# EAGLE design Stepper-Controller (EAGLE 9.6.2)
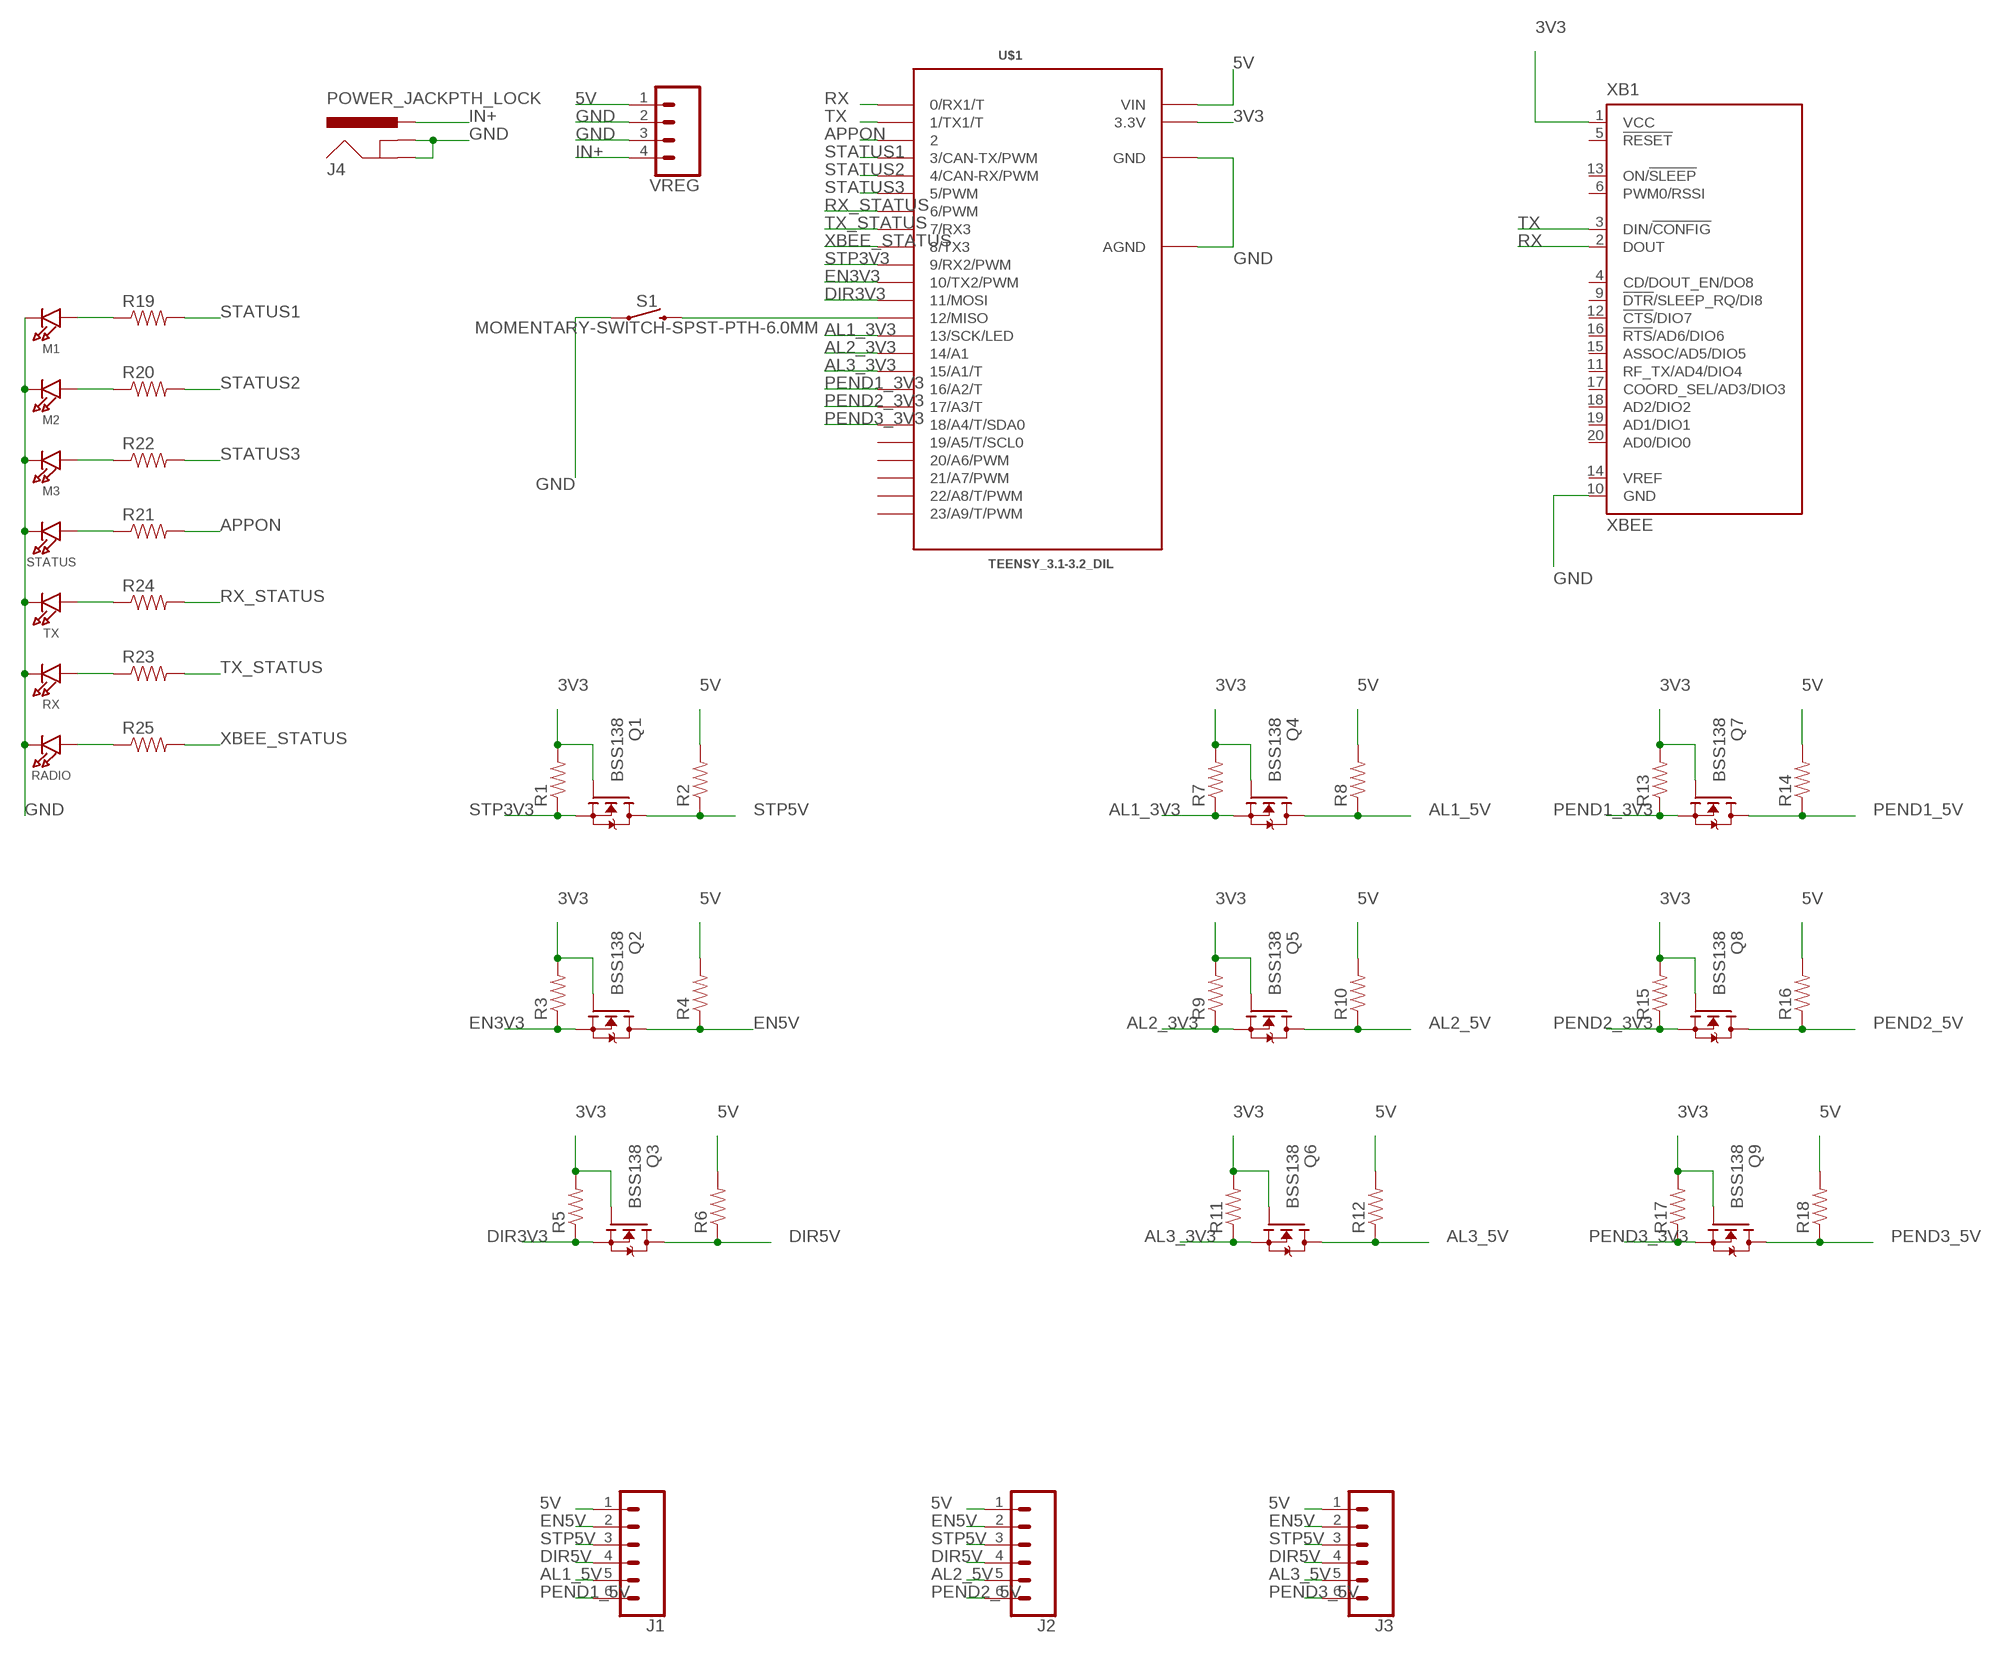
[diagram p0: schematic, sheet 1]

## Parts
J1  CONN_06NO_SILK_FEMALE_PTH  [1X06_NO_SILK]
J2  CONN_06NO_SILK_FEMALE_PTH  [1X06_NO_SILK]
J3  CONN_06NO_SILK_FEMALE_PTH  [1X06_NO_SILK]
J4  POWER_JACKPTH_LOCK  [POWER_JACK_PTH_LOCK]
M1  MICROBUILDER_LED0603  [MICROBUILDER_CHIPLED_0603]
M2  MICROBUILDER_LED0603  [MICROBUILDER_CHIPLED_0603]
M3  MICROBUILDER_LED0603  [MICROBUILDER_CHIPLED_0603]
Q1  BSS138  [SOT23]
Q2  BSS138  [SOT23]
Q3  BSS138  [SOT23]
Q4  BSS138  [SOT23]
Q5  BSS138  [SOT23]
Q6  BSS138  [SOT23]
Q7  BSS138  [SOT23]
Q8  BSS138  [SOT23]
Q9  BSS138  [SOT23]
R1  CONTROLBOARD_V1.0_SPARKFUN_RESISTOR0603-RES  [CONTROLBOARD_V1.0_SPARKFUN_0603-RES]
R2  CONTROLBOARD_V1.0_SPARKFUN_RESISTOR0603-RES  [CONTROLBOARD_V1.0_SPARKFUN_0603-RES]
R3  CONTROLBOARD_V1.0_SPARKFUN_RESISTOR0603-RES  [CONTROLBOARD_V1.0_SPARKFUN_0603-RES]
R4  CONTROLBOARD_V1.0_SPARKFUN_RESISTOR0603-RES  [CONTROLBOARD_V1.0_SPARKFUN_0603-RES]
R5  CONTROLBOARD_V1.0_SPARKFUN_RESISTOR0603-RES  [CONTROLBOARD_V1.0_SPARKFUN_0603-RES]
R6  CONTROLBOARD_V1.0_SPARKFUN_RESISTOR0603-RES  [CONTROLBOARD_V1.0_SPARKFUN_0603-RES]
R7  CONTROLBOARD_V1.0_SPARKFUN_RESISTOR0603-RES  [CONTROLBOARD_V1.0_SPARKFUN_0603-RES]
R8  CONTROLBOARD_V1.0_SPARKFUN_RESISTOR0603-RES  [CONTROLBOARD_V1.0_SPARKFUN_0603-RES]
R9  CONTROLBOARD_V1.0_SPARKFUN_RESISTOR0603-RES  [CONTROLBOARD_V1.0_SPARKFUN_0603-RES]
R10  CONTROLBOARD_V1.0_SPARKFUN_RESISTOR0603-RES  [CONTROLBOARD_V1.0_SPARKFUN_0603-RES]
R11  CONTROLBOARD_V1.0_SPARKFUN_RESISTOR0603-RES  [CONTROLBOARD_V1.0_SPARKFUN_0603-RES]
R12  CONTROLBOARD_V1.0_SPARKFUN_RESISTOR0603-RES  [CONTROLBOARD_V1.0_SPARKFUN_0603-RES]
R13  CONTROLBOARD_V1.0_SPARKFUN_RESISTOR0603-RES  [CONTROLBOARD_V1.0_SPARKFUN_0603-RES]
R14  CONTROLBOARD_V1.0_SPARKFUN_RESISTOR0603-RES  [CONTROLBOARD_V1.0_SPARKFUN_0603-RES]
R15  CONTROLBOARD_V1.0_SPARKFUN_RESISTOR0603-RES  [CONTROLBOARD_V1.0_SPARKFUN_0603-RES]
R16  CONTROLBOARD_V1.0_SPARKFUN_RESISTOR0603-RES  [CONTROLBOARD_V1.0_SPARKFUN_0603-RES]
R17  CONTROLBOARD_V1.0_SPARKFUN_RESISTOR0603-RES  [CONTROLBOARD_V1.0_SPARKFUN_0603-RES]
R18  CONTROLBOARD_V1.0_SPARKFUN_RESISTOR0603-RES  [CONTROLBOARD_V1.0_SPARKFUN_0603-RES]
R19  CONTROLBOARD_V1.0_SPARKFUN_RESISTOR0603-RES  [CONTROLBOARD_V1.0_SPARKFUN_0603-RES]
R20  CONTROLBOARD_V1.0_SPARKFUN_RESISTOR0603-RES  [CONTROLBOARD_V1.0_SPARKFUN_0603-RES]
R21  CONTROLBOARD_V1.0_SPARKFUN_RESISTOR0603-RES  [CONTROLBOARD_V1.0_SPARKFUN_0603-RES]
R22  CONTROLBOARD_V1.0_SPARKFUN_RESISTOR0603-RES  [CONTROLBOARD_V1.0_SPARKFUN_0603-RES]
R23  CONTROLBOARD_V1.0_SPARKFUN_RESISTOR0603-RES  [CONTROLBOARD_V1.0_SPARKFUN_0603-RES]
R24  CONTROLBOARD_V1.0_SPARKFUN_RESISTOR0603-RES  [CONTROLBOARD_V1.0_SPARKFUN_0603-RES]
R25  CONTROLBOARD_V1.0_SPARKFUN_RESISTOR0603-RES  [CONTROLBOARD_V1.0_SPARKFUN_0603-RES]
RADIO  MICROBUILDER_LED0603  [MICROBUILDER_CHIPLED_0603]
RX  MICROBUILDER_LED0603  [MICROBUILDER_CHIPLED_0603]
S1  MOMENTARY-SWITCH-SPST-PTH-6.0MM  [TACTILE_SWITCH_PTH_6.0MM]
STATUS  MICROBUILDER_LED0603  [MICROBUILDER_CHIPLED_0603]
TX  MICROBUILDER_LED0603  [MICROBUILDER_CHIPLED_0603]
U$1  TEENSY_3.1-3.2_DIL  [TEENSY_3.0-3.2&LC_DIL]
VREG  CONN_04LONGPADS  [1X04_LONGPADS]
XB1  XBEE  [XBEE]

## Nets
3V3: Q1.1(G) Q2.1(G) Q3.1(G) Q4.1(G) Q5.1(G) Q6.1(G) Q7.1(G) Q8.1(G) Q9.1(G) R1.2 R3.2 R5.2 R7.2 R9.2 R11.2 R13.2 R15.2 R17.2 U$1.3.3V XB1.1(VCC)
5V: J1.1 J2.1 J3.1 R2.2 R4.2 R6.2 R8.2 R10.2 R12.2 R14.2 R16.2 R18.2 U$1.VIN VREG.1
AL1_3V3: Q4.2(S) R7.1 U$1.13(13/SCK/LED)
AL1_5V: J1.5 Q4.3(D) R8.1
AL2_3V3: Q5.2(S) R9.1 U$1.14/A0(14/A1)
AL2_5V: J2.5 Q5.3(D) R10.1
AL3_3V3: Q6.2(S) R11.1 U$1.15/A1(15/A1/T)
AL3_5V: J3.5 Q6.3(D) R12.1
APPON: R21.2 U$1.2
DIR3V3: Q3.2(S) R5.1 U$1.11(11/MOSI)
DIR5V: J1.4 J2.4 J3.4 Q3.3(D) R6.1
EN3V3: Q2.2(S) R3.1 U$1.10(10/TX2/PWM)
EN5V: J1.2 J2.2 J3.2 Q2.3(D) R4.1
GND: J4.GND J4.GNDBREAK M1.C M2.C M3.C RADIO.C RX.C S1.1 STATUS.C TX.C U$1.AGND U$1.GND VREG.2 VREG.3 XB1.10(GND)
IN+: J4.PWR VREG.4
N$1: M1.A R19.1
N$2: M2.A R20.1
N$3: S1.3 U$1.12(12/MISO)
N$6: R21.1 STATUS.A
N$7: M3.A R22.1
N$10: R23.1 RX.A
N$11: R24.1 TX.A
N$14: R25.1 RADIO.A
PEND1_3V3: Q7.2(S) R13.1 U$1.16/A2(16/A2/T)
PEND1_5V: J1.6 Q7.3(D) R14.1
PEND2_3V3: Q8.2(S) R15.1 U$1.17/A3(17/A3/T)
PEND2_5V: J2.6 Q8.3(D) R16.1
PEND3_3V3: Q9.2(S) R17.1 U$1.18/A4(18/A4/T/SDA0)
PEND3_5V: J3.6 Q9.3(D) R18.1
RX: U$1.0(0/RX1/T) XB1.2(DOUT)
RX_STATUS: R24.2 U$1.6(6/PWM)
STATUS1: R19.2 U$1.3(3/CAN-TX/PWM)
STATUS2: R20.2 U$1.4(4/CAN-RX/PWM)
STATUS3: R22.2 U$1.5(5/PWM)
STP3V3: Q1.2(S) R1.1 U$1.9(9/RX2/PWM)
STP5V: J1.3 J2.3 J3.3 Q1.3(D) R2.1
TX: U$1.1(1/TX1/T) XB1.3(DIN/!CONFIG)
TX_STATUS: R23.2 U$1.7(7/RX3)
XBEE_STATUS: R25.2 U$1.8(8/TX3)
Unconnected: U$1.19/A5(19/A5/T/SCL0) U$1.20/A6(20/A6/PWM) U$1.21/A7(21/A7/PWM) U$1.22/A8(22/A8/T/PWM) U$1.23/A9(23/A9/T/PWM) XB1.4(CD/DOUT_EN/DO8) XB1.5(!RESET) XB1.6(PWM0/RSSI) XB1.9(!DTR!/SLEEP_RQ/DI8) XB1.11(RF_TX/AD4/DIO4) XB1.12(!CTS!/DIO7) XB1.13(ON/!SLEEP) XB1.14(VREF) XB1.15(ASSOC/AD5/DIO5) XB1.16(!RTS!/AD6/DIO6) XB1.17(COORD_SEL/AD3/DIO3) XB1.18(AD2/DIO2) XB1.19(AD1/DIO1) XB1.20(AD0/DIO0)

## Library data of the parts
J1-J3 = SparkFun-Connectors:CONN_06: Multi connection point. Often used as Generic Header-pin footprint for 0.1 inch spaced/style header connections On any of the 0.1 inch spaced packages, you can populate with these: Break Away Headers - Straight <https://www.sparkfun.com/products/116> (PRT-00116) Break Away Male Headers - Right Angle <https://www.sparkfun.com/products/553> (PRT-00553) Female Headers <https://www.sparkfun.com/products/115> (PRT-00115) Break Away Headers - Machine Pin <https://www.sparkfun.com/products/117> (PRT-00117) Break Away Female Headers - Swiss Machine Pin <https://www.sparkfun.com/products/743> (PRT-00743) Arduino Stackable Header - 6 Pin <https://www.sparkfun.com/products/9280> (PRT-09280) For SCREWTERMINALS and SPRING TERMINALS visit here: Screw Terimnals on SparkFun.com <https://www.sparkfun.com/search/results?term=Screw+Terminals> (5mm/3.5mm/2.54mm spacing) This device is also useful as a general connection point to wire up your design to another part of your project. Our various solder wires solder well into these plated through hole pads. Hook-Up Wire - Assortment (Stranded, 22 AWG) <https://www.sparkfun.com/products/11375> (PRT-11375) Hook-Up Wire - Assortment (Solid Core, 22 AWG) <https://www.sparkfun.com/products/11367> (PRT-11367) View the entire wire category on our website here <https://www.sparkfun.com/categories/141>; PROD_ID: CONN-08437
J4 = SparkFun-Connectors:POWER_JACK: Power Jack Connector This is the standard 5.5mm barrel jack for power. The PTH is the most common, proven, reliable, footprint. The Slot footprint only works if the mill layer is transmitted to the PCB fab house so be warned. Here are the connectors we sell at SparkFun: DC Barrel Power Jack/Connector <https://www.sparkfun.com/products/119> (PRT-00119) DC Barrel Power Jack/Connector (SMD) <https://www.sparkfun.com/products/12748> (PRT-12748) DC Barrel Jack Adapter - Breadboard Compatible <https://www.sparkfun.com/products/10811> (PRT-10811) It is used on this SparkFun product (and many, many others): SparkFun RedBoard - Programmed with Arduino <https://www.sparkfun.com/products/12757> (DEV-12757) Also, if you need a mating power supply or connector, please check these out: Wall Adapter Power Supply - 9VDC 650mA <https://www.sparkfun.com/products/298> (TOL-00298) DC Barrel Jack Adapter - Male <https://www.sparkfun.com/products/10287> (PRT-10287); PROD_ID: CONN-08197; SF_ID: PRT-00119
M1-M3 RADIO RX STATUS TX = Adafruit Feather M0 Basic rev C:MICROBUILDER_LED: LED 0603 - 0603 Surface Mount Package 2mA: Green LED - Low Power (3.9mcd, 2ma, 1.7Vf) - Digikey: 475-2709-2-ND Orange LED - Low Power (9.8mcd, 2ma, 1.8Vf) - Digikey: 475-1194-2-ND Red LED - Low Power (5mcd, 2ma, 1.8Vf) - Digikey: 475-1195-2-ND Yellow LED - Low Power (7mcd, 2ma, 1.8Vf) - Digikey: 475-1196-2-ND 5mA: Blue LED - Low Power (17mcd, 5ma, 2.9Vf) - Digikey: LNJ937W8CRACT-ND 0805 - 0805 Surface Mount Package 2mA: Red LED (8.8mcd, 2mA, 1.8Vf, Clear) - Low Power [Digikey: 475-2510-1-ND] Green LED (5mcd, 2mA, 1.8Vf, Clear) - Low Power [Digikey: 475-2730-1-ND] Yellow LED (11.3mcd, 2mA, 1.8Vf, Clear) - Low Power [Digikey: 475-2555-1-ND] 20mA: Red LED (104mcd, 20mA, Diffused) - LS R976 [Digikey: 475-1278-6-ND] Red LED (12mcd, 20mA, 2.0Vf, Clear) - APT2012EC [Digikey: 754-1128-1-ND] Green LED (15mcd, 20mA, 2.2Vf, Clear) - APT2012GC [Digikey: 754-1131-1-ND] Orange LED (160mcd, 20mA, 2.1Vf, Clear) - APT2012SECK [Digikey: 754-1130-1-ND] 1206 - 1206 Surface Mount Package Green LED (26mcd, 20mA, Diffused) - LG N971 [Digikey: 475-1407-6-ND] Red LED (15mcd, 20mA, Diffused) - LH N974 [Digikey: 475-1416-6-ND] Cree - Cree High-Power Surface Mount LEDs XPEBWT-L1-0000-00D50 - White 111lm 350mA 2.9Vf 6200K 110° XTEAWT-00-0000-00000LEE3 - White 114lm 350mA 2.85Vf 5000K 115° Everlight - Everlight 45-21 Series Surface Mount LEDs 45-21/QK2C-B2832AC2CB2/2T - Warm White 2000mcd 20mA 3.25Vf 3050K 120° 45-21/LK2C-B38452C4CB2/2T - Nuetral White 2000mcd 20mA 3.25Vf 4150K 120° 45-21/LK2C-B50634C6CB2/2T - Cold White 2200mcd 20mA 3.25Vf 5650K 120° PLCC2 Reverse Mount LS T77K-J1L2-1-0-2-R18-Z - Red 11.25mcd 2mA 1.8Vf 630nm 120° LO T77K-L1M2-24-Z - Orange 19.6mcd 2mA 1.8Vf 606nm 120° LY T77K-K2M1-26-Z - Yellow 15.7mcd 2mA 1.8Vf 587nm 120°
Q1-Q9 = bss138_10:BSS138: BSS138 N-Channel Logic Level Enhancement Mode Field Effect Transistor Source: http://www.fairchildsemi.com/datasheets/BS/BSS138.pdf; MF: Fairchild; MPN: BSS138; OC_FARNELL: 9845330; OC_NEWARK: 67R2009
R1-R25 = Lighting_Controller_1.1:CONTROLBOARD_V1.0_SPARKFUN_RESISTOR: Resistor Basic schematic elements and footprints for 0603, 1206, and PTH resistors.
S1 = SparkFun-Switches:MOMENTARY-SWITCH-SPST: Momentary Switch (Pushbutton) - SPST Normally-open (NO) SPST momentary switches (buttons, pushbuttons). Variants PTH-12MM - 12mm square, through-hole Momentary Pushbutton Switch - 12mm Square <https://www.sparkfun.com/products/9190> (COM-09190) PTH-6.0MM, PTH-6.0MM-KIT - 6.0mm square, through-hole Mini Pushbutton Switch <https://www.sparkfun.com/products/97> (COM-00097) KIT package intended for soldering kit's - only one side of pads' copper is exposed. PTH-RIGHT-ANGLE-KIT - Right-angle, through-hole Right Angle Tactile Button <https://www.sparkfun.com/products/10791> - Used on SparkFun BigTime Watch Kit <https://www.sparkfun.com/products/11734> SMD-12MM - 12mm square, surface-mount Tactile Button - SMD (12mm) <https://www.sparkfun.com/products/12993> (COM-12993) Used on SparkFun PicoBoard <https://www.sparkfun.com/products/11888> SMD-4.5MM - 4.5mm Square Trackball Switch Used on SparkFun Blackberry Trackballer Breakout <https://www.sparkfun.com/products/13169> SMD-4.6MMX2.8MM - 4.60mm x 2.80mm, surface mount Used on SparkFun SAMD21 Mini Breakout <https://www.sparkfun.com/products/13664> SMD-5.2MM, SMD-5.2-REDUNDANT - 5.2mm square, surface-mount Mini Pushbutton Switch - SMD <https://www.sparkfun.com/products/8720> (COM-08720) Used on Arduino Pro Mini <https://www.sparkfun.com/products/11114> REDUNDANT package connects both switch circuits together SMD-6.0X3.5MM - 6.0 x 3.5mm, surface mount Momentary Reset Switch SMD <https://www.sparkfun.com/products/8229> (COM-08229) SMD-6.2MM-TALL - 6.2mm square, surface mount Tactile Button - SMD (6mm) <https://www.sparkfun.com/products/12992> Used on SparkFun Digital Sandbox <https://www.sparkfun.com/products/12651> SMD-RIGHT-ANGLE - Right-angle, surface mount Used on SparkFun Block for Intel® Edison - Arduino <https://www.sparkfun.com/products/13036>; PROD_ID: SWCH-08441; SF_SKU: COM-00097
U$1 = Teensy_3_and_LC_Series_Boards_v1.4:TEENSY_3.1-3.2_DIL: Teensy 3.1 or 3.2 in a DIL Layout.
VREG = SparkFun-Connectors:CONN_04: Multi connection point. Often used as Generic Header-pin footprint for 0.1 inch spaced/style header connections On any of the 0.1 inch spaced packages, you can populate with these: Break Away Headers - Straight <https://www.sparkfun.com/products/116> (PRT-00116) Break Away Male Headers - Right Angle <https://www.sparkfun.com/products/553> (PRT-00553) Female Headers <https://www.sparkfun.com/products/115> (PRT-00115) Break Away Headers - Machine Pin <https://www.sparkfun.com/products/117> (PRT-00117) Break Away Female Headers - Swiss Machine Pin <https://www.sparkfun.com/products/743> (PRT-00743) For SCREWTERMINALS and SPRING TERMINALS visit here: Screw Terimnals on SparkFun.com <https://www.sparkfun.com/search/results?term=Screw+Terminals> (5mm/3.5mm/2.54mm spacing) This device is also useful as a general connection point to wire up your design to another part of your project. Our various solder wires solder well into these plated through hole pads. Hook-Up Wire - Assortment (Stranded, 22 AWG) <https://www.sparkfun.com/products/11375> (PRT-11375) Hook-Up Wire - Assortment (Solid Core, 22 AWG) <https://www.sparkfun.com/products/11367> (PRT-11367) View the entire wire category on our website here <https://www.sparkfun.com/categories/141> Special notes: Molex polarized connector foot print use with SKU : PRT-08231 with associated crimp pins and housings. 1MM SMD Version SKU: PRT-10208; PROD_ID: CONN-09696
XB1 = maxstream:XBEE: XBee (TM) /XBee-PRO(TM) OEM RF Modules Source: MaxStream, Inc. xbee_productmanual.pdf; MPN: XBP24-Z7UIT-004; OC_FARNELL: 1751799; OC_NEWARK: 34R5507

## Board
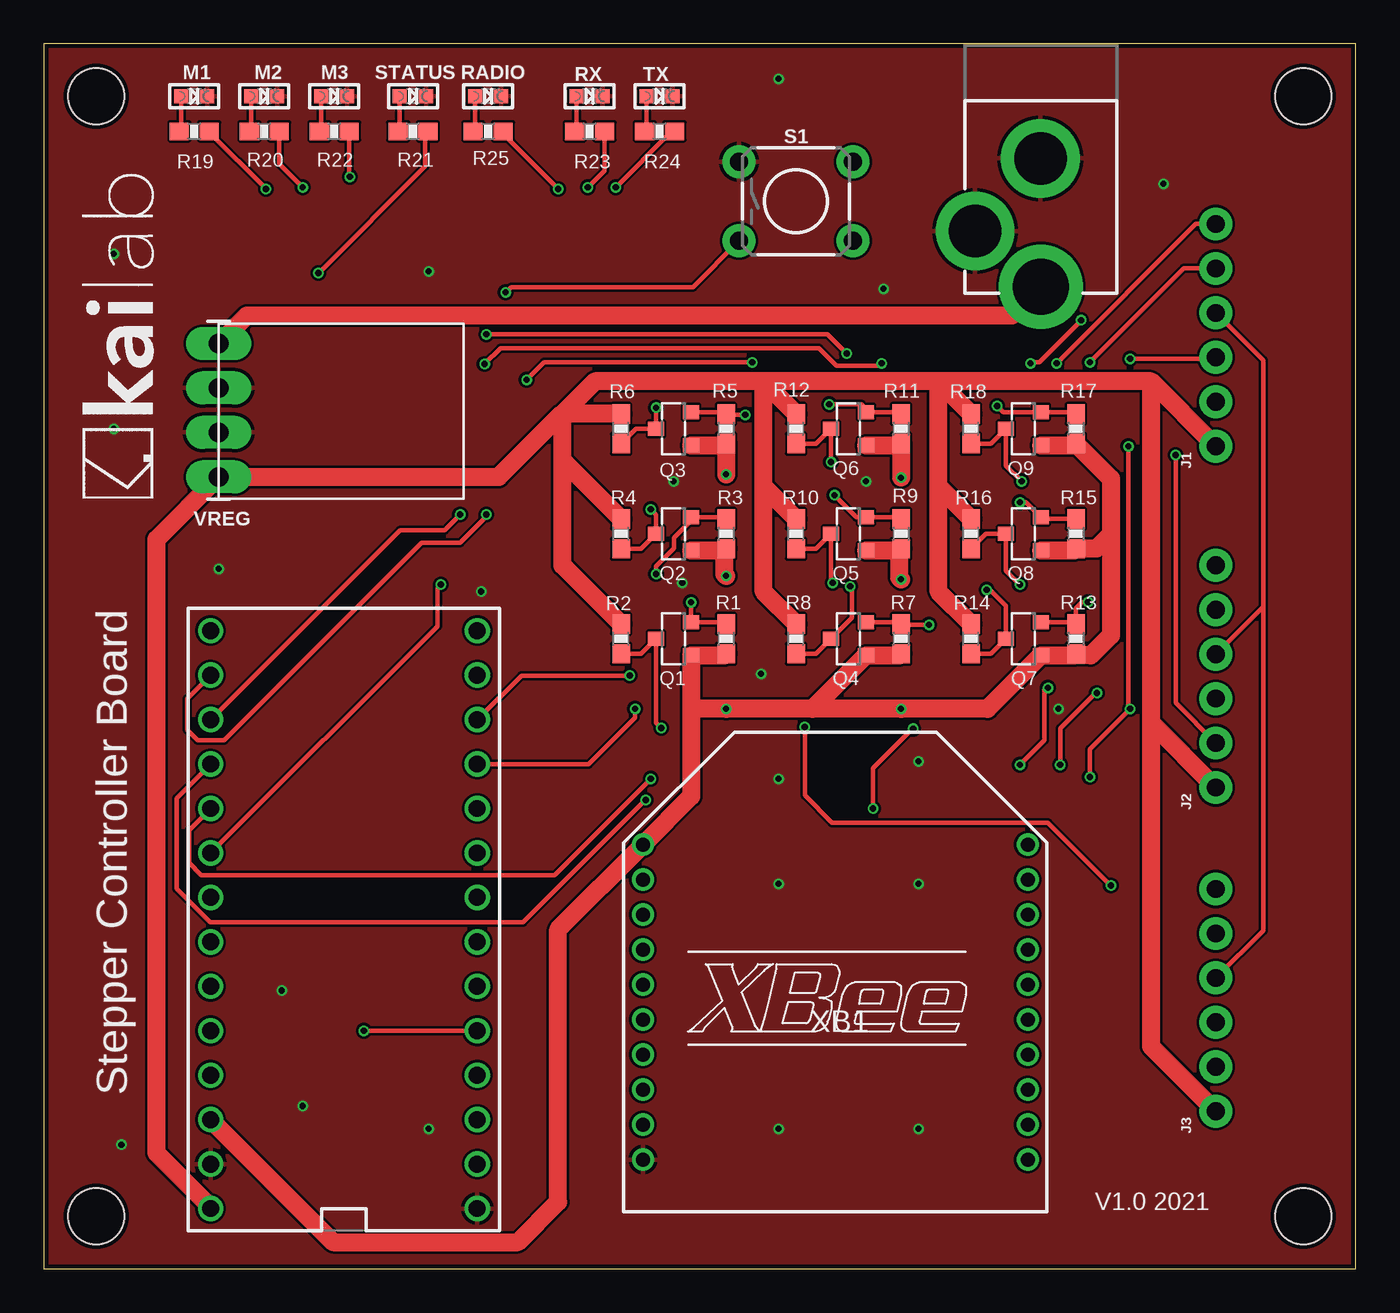
[diagram p1: board, top side]
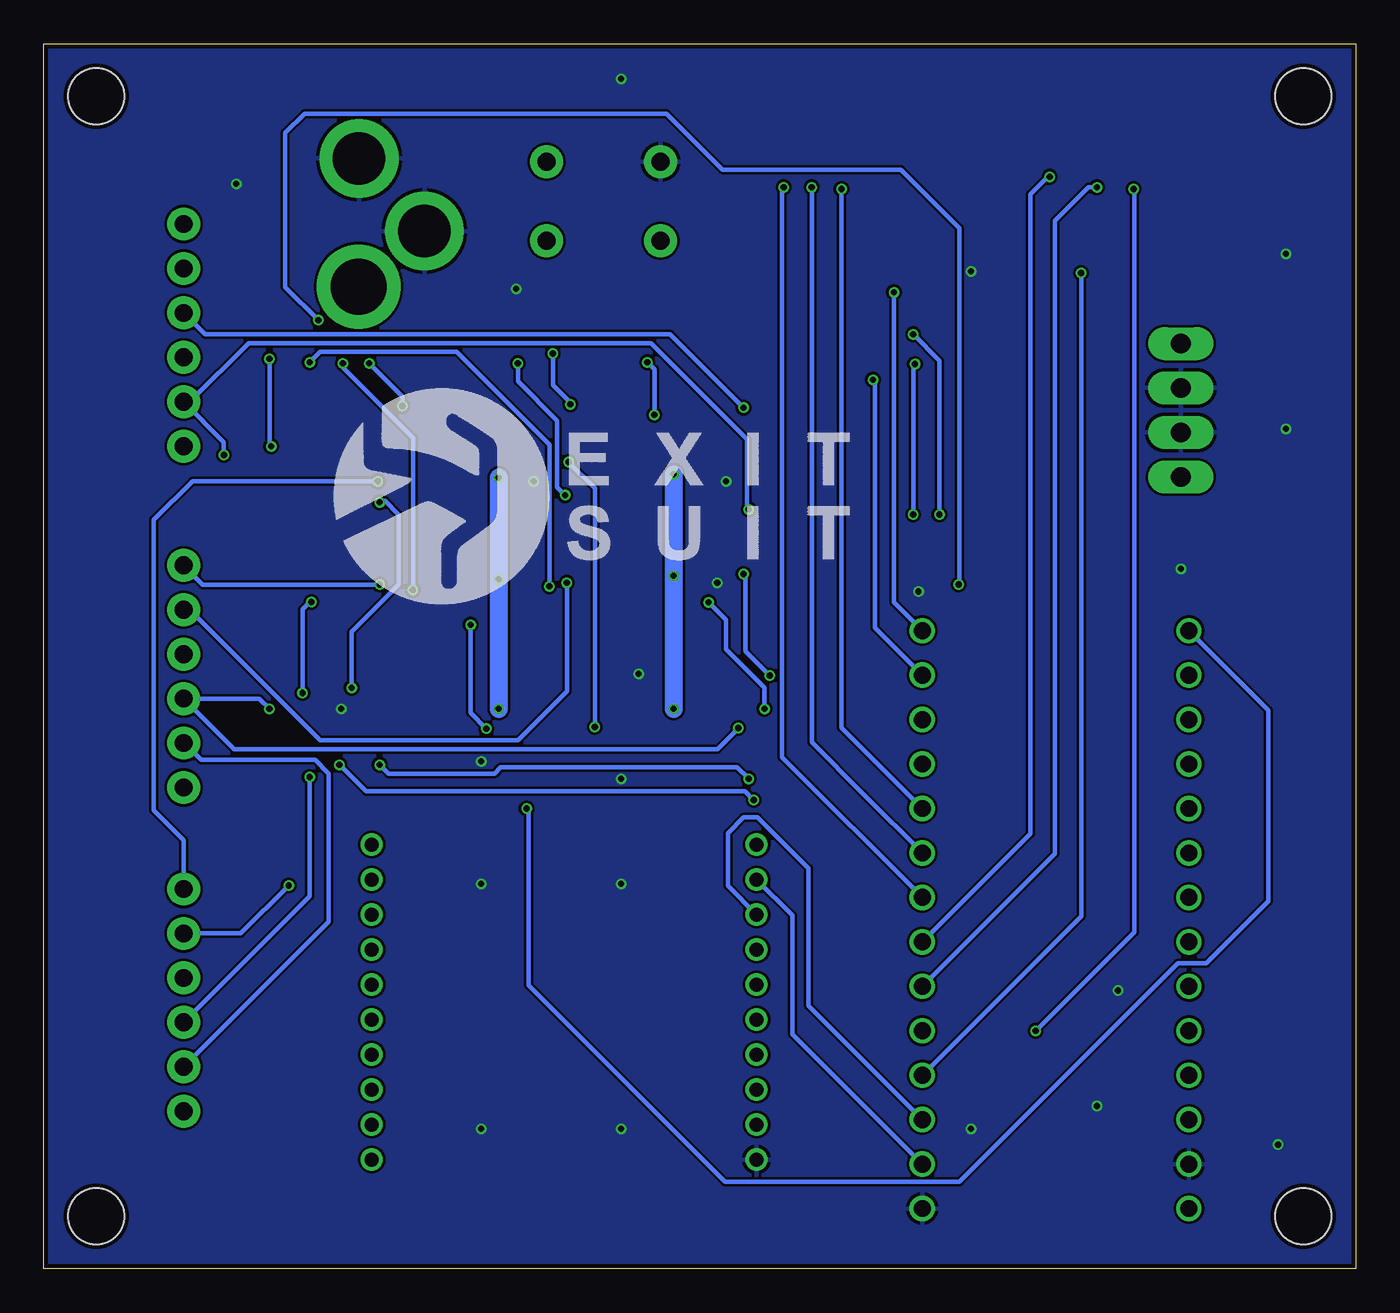
[diagram p2: board, bottom side, seen from below]

Size 75 x 70 mm. Coordinates in mm from the lower left corner, seen from the top.
Outline: 0,0 75,0 75,70 0,70 0,0
Copper layers (1*16): Top 0.018mm / dielectric 1.55mm / Bottom 0.018mm
Design rules "eC_2Layer_PClass6_BaseCopperO18_eCDefault": minimum track width 0.15mm, minimum drill 0.35mm, track to track 0.15mm, track to pad 0.15mm, pad to pad 0.15mm, via to via 0.15mm, smd to smd 0mil, copper to edge 0.25mm, drill to drill 0.35mm, minimum pad ring 0.175mm, minimum via ring 0.125mm, stop-mask expansion 0mil, vias tented up to drill 0.45mm, thermal gap 0.2mm
Holes 3.2 mm at 3,67 72,67 72,3 3,3

### Footprints (pad centres in the part's own frame; a part is rotated, then mirrored left to right if it is on the bottom)
1X06_NO_SILK = drill 1.016 pad 1.88: 1 0,0; 2 2.54,0; 3 5.08,0; 4 7.62,0; 5 10.16,0; 6 12.7,0
POWER_JACK_PTH_LOCK = drill 2.997 pad 4.115: GND 0.025,6.557; GNDBREAK 3.762,10.7 | drill 3.2 pad 4.115: PWR 0,13.878
MICROBUILDER_CHIPLED_0603 = smd 0.8 x 0.8: A 0,-0.75; C 0,0.75
SOT23 = smd 0.8 x 0.9: 1 -0.95,-1; 2 0.95,-1; 3 0,1
CONTROLBOARD_V1.0_SPARKFUN_0603-RES = smd 1.1 x 1: 1 -0.85,0; 2 0.85,0
TACTILE_SWITCH_PTH_6.0MM = drill 1.016 pad 1.88: 1 -3.251,2.261; 2 3.251,2.261; 3 -3.251,-2.261; 4 3.251,-2.261
TEENSY_3.0-3.2&LC_DIL = drill 0.965: 0 -7.62,13.97; 1 -7.62,11.43; 2 -7.62,8.89; 3 -7.62,6.35; 3.3V 7.62,11.43; 4 -7.62,3.81; 5 -7.62,1.27; 6 -7.62,-1.27; 7 -7.62,-3.81; 8 -7.62,-6.35; 9 -7.62,-8.89; 10 -7.62,-11.43; 11 -7.62,-13.97; 12 -7.62,-16.51; 13 7.62,-16.51; 14/A0 7.62,-13.97; 15/A1 7.62,-11.43; 16/A2 7.62,-8.89; 17/A3 7.62,-6.35; 18/A4 7.62,-3.81; 19/A5 7.62,-1.27; 20/A6 7.62,1.27; 21/A7 7.62,3.81; 22/A8 7.62,6.35; 23/A9 7.62,8.89; AGND 7.62,13.97; GND -7.62,16.51; VIN 7.62,16.51
1X04_LONGPADS = drill 1.118 pad 1.88 long: 1 0,0; 2 2.54,0; 3 5.08,0; 4 7.62,0
XBEE = drill 0.8 pad 1.27: 1 -11,9; 2 -11,7; 3 -11,5; 4 -11,3; 5 -11,1; 6 -11,-1; 7 -11,-3; 8 -11,-5; 9 -11,-7; 10 -11,-9; 11 11,-9; 12 11,-7; 13 11,-5; 14 11,-3; 15 11,-1; 16 11,1; 17 11,3; 18 11,5; 19 11,7; 20 11,9

### Placement (x,y rotation side)
J1  67,47 90 top
J2  67,27.5 90 top
J3  67,9 90 top
J4  57,70 180 top
M1  8.6,67 270 top
M2  12.6,67 270 top
M3  16.6,67 270 top
Q1  36,36 90 top
Q2  36,42 90 top
Q3  36,48 90 top
Q4  46,36 90 top
Q5  46,42 90 top
Q6  46,48 90 top
Q7  56,36 90 top
Q8  56,42 90 top
Q9  56,48 90 top
R1  39,36 270 top
R2  33,36 90 top
R3  39,42 270 top
R4  33,42 90 top
R5  39,48 270 top
R6  33,48 90 top
R7  49,36 270 top
R8  43,36 90 top
R9  49,42 270 top
R10  43,42 90 top
R11  49,48 270 top
R12  43,48 90 top
R13  59,36 270 top
R14  53,36 90 top
R15  59,42 270 top
R16  53,42 90 top
R17  59,48 270 top
R18  53,48 90 top
R19  8.6,65 0 top
R20  12.6,65 0 top
R21  21.1,65 0 top
R22  16.6,65 0 top
R23  31.2,65 0 top
R24  35.2,65 0 top
R25  25.4,65 0 top
RADIO  25.4,67 270 top
RX  31.2,67 270 top
S1  43,61 0 top
STATUS  21.1,67 270 top
TX  35.2,67 270 top
U$1  17.16,19.95 180 top
VREG  10,45.25 90 top
XB1  45.25,15.24 0 top

### Tracks (layer width: path | path; a pad name or v marks a point on that pad's centre or on a via)
3V3  (via drill 0.35)
  Top 1.016: U$1.3.3V 16.54,1.52 27.1,1.52 29.4,3.82 29.4,19.39 XB1.1 37,26.99 37,32 | 37,32 Q1.1 38.9,35.05 R1.2 | 43.95,32 Q4.1 48.9,35.05 R7.2 | 43.95,32 v39,32 37,32 | 43.95,32 v49,32 53.95,32 Q7.1 58.9,35.05 | Q3.1 38.9,47.05 R5.2 v39,45.4 | Q6.1 48.9,47.05 R11.2 v49,45.2 | Q9.1 58.9,47.05 R17.2 61,45.15 61,41.97 | Q8.1 58.9,41.05 R15.2 60.18,41.15 61,41.97 | Q5.1 48.9,41.05 | 48.9,41.05 R9.2 | Q2.1 38.9,41.05 | 38.9,41.05 R3.2 | 58.9,35.05 R13.2 | 61,41.97 61,36.2 59.85,35.05 58.9,35.05 | v39,39.6 38.9,39.7 38.9,41.05 | v49,39.4 48.9,39.5 48.9,41.05
  Bottom 1.016: v39,45.4 v39,39.6 v39,32 | v49,45.2 v49,39.4 v49,32
5V
  Top 1.016: R6.2 29.65,48.85 | R12.2 41.15,50.7 | 29.65,48.85 29.6,48.85 26,45.25 VREG.1 6.44,41.69 6.44,6.6 9.54,3.5 U$1.VIN | 41.15,50.7 31.5,50.7 29.65,48.85 | R18.2 51.15,50.7 | 51.15,50.7 41.15,50.7 | R4.2 29.65,46.2 | 29.65,46.2 29.65,48.85 | R10.2 41.15,44.7 | 41.15,44.7 41.15,50.7 | R16.2 51.15,44.7 | 51.15,44.7 51.15,50.7 | R14.2 51.15,38.7 51.15,44.7 | R8.2 41.15,38.7 41.15,44.7 | R2.2 29.65,40.2 29.65,46.2 | J1.1 63.3,50.7 | 63.3,50.7 51.15,50.7 | J2.1 63.3,31.2 | 63.3,31.2 63.3,50.7 | J3.1 63.3,12.7 63.3,31.2
AL1_3V3  (via drill 0.35)
  Top 0.254: Q4.2 48.9,36.95 R7.1 49.05,36.8 v50.6,36.8 | v47.4,26.3 47.4,28.6 49.66,30.86 v49.7,30.86
  Bottom 0.254: U$1.13 5,31.92 5,21 8.54,17.46 10.16,17.46 22.65,4.96 36.06,4.96 47.3,16.2 47.3,26.3 v47.4,26.3 | v49.7,30.86 50.6,31.76 v50.6,36.8
AL1_5V  (via drill 0.35)
  Top 0.254: R8.1 44.15,35.15 Q4.3 46.2,37.2 46.2,39 v46.1,39 | v59.8,51.8 65.16,57.16 J1.5
  Bottom 0.254: v46.1,39 46.1,47.1 51.4,52.4 59.2,52.4 v59.8,51.8
AL2_3V3  (via drill 0.35)
  Top 0.254: R9.1 48.9,42.95 Q5.2 46.45,42.95 v45.2,44.2 | U$1.14/A0 8.2,32.58 8.2,30.8 8.8,30.2 10.3,30.2 21.6,41.5 23.8,41.5 25.2,42.9 25.2,43.1 v25.3,43.1 | v25.2,51.7 26.1,52.6 44.3,52.6 45.3,51.6 47.9,51.6 v47.9,51.74
  Bottom 0.254: v25.3,43.1 25.3,51.7 v25.2,51.7 | v47.9,51.74 47.9,50.7 45.66,48.46 45.66,44.66 v45.2,44.2
AL2_5V  (via drill 0.35)
  Top 0.254: R10.1 44.15,41.15 Q5.3 45,39.3 v45.1,39.2
  Bottom 0.254: v45.1,39.2 45.1,33 47.9,30.2 59.2,30.2 66.66,37.66 J2.5
AL3_3V3  (via drill 0.35)
  Top 0.254: Q6.2 47.2,48.95 | 47.2,48.95 48.9,48.95 R11.1 | U$1.15/A1 20.36,42.2 22.9,42.2 v23.8,43.1 | v25.3,53.4 44.8,53.4 v45.9,52.3 | v44.9,49.4 46.75,49.4 47.2,48.95
  Bottom 0.254: v25.3,53.4 23.8,51.9 v23.8,43.1 | v45.9,52.3 45.9,50.5 44.9,49.5 v44.9,49.4
AL3_5V  (via drill 0.35)
  Top 0.254: R12.1 44.15,47.15 Q6.3 v45,46.1 | v43.5,30.96 43.5,27.06 45.06,25.5 57.4,25.5 v61,21.9
  Bottom 0.254: v45,46.1 43.5,44.6 v43.5,30.96 | v61,21.9 63.74,19.16 J3.5
APPON  (via drill 0.35)
  Top 0.254: v15.7,56.9 21.8,63 21.8,64.85 R21.2
  Bottom 0.254: U$1.2 15.7,20.14 v15.7,56.9
DIR3V3  (via drill 0.35)
  Top 0.254: Q3.2 38.9,48.95 R5.1 39.05,48.8 v40.1,48.8 | v27.6,50.8 28.6,51.8 v40.5,51.8
  Bottom 0.254: U$1.11 27.5,36.64 27.5,50.7 v27.6,50.8 | v40.5,51.8 40.1,51.4 v40.1,48.8
DIR5V  (via drill 0.35)
  Top 0.254: R6.1 33.85,48 Q3.3 v35,49.2 | J1.4 69.7,51.92 69.7,37.82 | 69.7,37.82 J2.4 | J3.4 69.7,19.32 69.7,37.82
  Bottom 0.254: v35,49.2 39.2,53.4 65.78,53.4 J1.4
EN3V3  (via drill 0.35)
  Top 0.254: R3.1 38.9,42.95 Q2.2 37,42.75 36.03,41.78 36.03,41.18 35,40.16 v35,39.7 | U$1.10 27.3,33.9 v33.5,33.9
  Bottom 0.254: v33.5,33.9 34.9,35.3 34.9,39.7 v35,39.7
EN5V  (via drill 0.35)
  Top 0.254: R4.1 34.15,41.15 Q2.3 35,43.1 v34.7,43.4 | v64.7,46.5 64.7,32.34 J2.2
  Bottom 0.254: v34.7,43.4 34.8,43.4 34.8,47.4 40.3,52.9 63.3,52.9 66.66,49.54 J1.2 64.7,47.24 v64.7,46.5 | J3.2 58.7,19.84 58.7,28.3 59.49,29.09 65.99,29.09 66.94,30.04 J2.2
GND  (via drill 0.35)
  other vias: 4,58 22,57 42,68 48,56 64,62 4,48 10,40 25,38.7 42,28 50,29 58,32 50,22 42,22 42,8 50,8 14.8,9.3 22,8 13.6,15.9 4.44,7.09 41,34 47,45 36.5,39.2 36,45
  pour Top: 0,70 75,70 75,0 0,0
  pour Bottom: 0,70 75,70 75,0 0,0
IN+
  Top 1.016: J4.PWR 55.35,54.47 11.6,54.47 VREG.4
N$1
  Top 0.254: M1.A 7.85,65.1 R19.1
N$2
  Top 0.254: M2.A 11.85,65.1 R20.1
N$3  (via drill 0.35)
  Top 0.254: S1.3 37.11,56.1 26.7,56.1 v26.4,55.8
  Bottom 0.254: v26.4,55.8 26.4,38.08 U$1.12
N$6
  Top 0.254: STATUS.A 20.35,65.1 R21.1
N$7
  Top 0.254: M3.A 15.85,65.1 R22.1
N$10
  Top 0.254: RX.A 30.45,65.1 R23.1
N$11
  Top 0.254: TX.A 34.45,65.1 R24.1
N$14
  Top 0.254: RADIO.A 24.65,65.1 R25.1
PEND1_3V3  (via drill 0.35)
  Top 0.254: Q7.2 58.9,36.95 R13.1 59,37.75 59.35,38.1 v59.7,38.1 | U$1.16/A2 7.6,26.9 7.6,21.72 9.52,19.8 27.4,19.8 v34.4,26.8 v34.41,26.79 | v58.1,28.8 58.1,30.9 60.1,32.9 v60.2,32.9
  Bottom 0.254: v34.41,26.79 34.91,27.29 56.59,27.29 v58.1,28.8 | v60.2,32.9 60.2,37.7 59.8,38.1 v59.7,38.1
PEND1_5V  (via drill 0.35)
  Top 0.254: R14.1 54.15,35.15 Q7.3 55,37.9 54,38.9 v53.9,38.8 | v57.9,51.74 65.86,59.7 J1.6
  Bottom 0.254: v53.9,38.8 53.9,47.5 57.9,51.5 v57.9,51.74
PEND2_3V3  (via drill 0.35)
  Top 0.254: R15.1 57.1,42.85 Q8.2 56.15,43.8 v55.8,43.8 | U$1.17/A3 8.3,25.06 8.3,23.2 9,22.5 29.2,22.5 v34.7,28 | v55.8,28.8 57.2,30.2 57.2,33.1 57.3,33.2 v57.4,33.2
  Bottom 0.254: v34.7,28 35.36,28.66 48.87,28.66 49.23,28.3 55.3,28.3 v55.8,28.8 | v57.4,33.2 57.4,36.4 54.7,39.1 54.7,43.1 55.5,43.9 55.8,43.9 v55.8,43.8
PEND2_5V  (via drill 0.35)
  Top 0.254: R16.1 53.85,42 Q8.3 55,39.9 v55.8,39.1
  Bottom 0.254: v55.8,39.1 65.9,39.1 J2.6
PEND3_3V3  (via drill 0.35)
  Top 0.254: R17.1 58.9,48.95 Q9.2 54.85,48.95 v54.5,49.3 | U$1.18/A4 22.5,36.72 22.5,38.9 v22.7,39.1 | v59.3,54.2 56.9,51.8 56.4,51.8 v56.4,51.74
  Bottom 0.254: v22.7,39.1 22.66,39.14 22.66,59.46 26,62.8 36.2,62.8 39.4,66 60.1,66 61.2,64.9 61.2,56.1 v59.3,54.2 | v56.4,51.74 54.5,49.84 v54.5,49.3
PEND3_5V  (via drill 0.35)
  Top 0.254: R18.1 54.15,47.15 Q9.3 55,45.9 v55.9,45
  Bottom 0.254: v55.9,45 66.5,45 68.7,42.8 68.7,26.2 67,24.5 J3.6
RX
  Bottom 0.254: U$1.0 32.2,13.4 32.2,20.19 XB1.2
RX_STATUS  (via drill 0.35)
  Top 0.254: v32.7,61.8 35.75,64.85 35.9,64.85 R24.2
  Bottom 0.254: U$1.6 32.8,29.24 32.8,61.7 v32.7,61.8
STATUS1  (via drill 0.35)
  Top 0.254: v12.7,61.7 9.45,64.95 R19.2 | v18.3,13.6 U$1.3
  Bottom 0.254: v12.7,61.7 12.66,61.66 12.66,19.24 v18.3,13.6
STATUS2  (via drill 0.35)
  Top 0.254: v14.8,61.8 13.45,63.15 R20.2
  Bottom 0.254: v14.8,61.8 15.3,61.8 17.2,59.9 17.2,23.72 U$1.4
STATUS3  (via drill 0.35)
  Top 0.254: v17.5,62.4 17.45,62.45 R22.2
  Bottom 0.254: v17.5,62.4 17.6,62.4 18.6,61.4 18.6,24.86 U$1.5
STP3V3  (via drill 0.35)
  Top 0.254: R1.1 38.9,36.95 Q1.2 v37,38.08 | U$1.9 31.14,28.84 33.8,31.5 v33.8,32
  Bottom 0.254: v33.8,32 33.8,33.2 36,35.4 36,37.08 v37,38.08
STP5V  (via drill 0.35)
  Top 0.254: R2.1 34.15,35.15 Q1.3 35,31.2 v35.3,30.9 | J1.3 66.92,52 v62.1,52 | v62,47 62,32.1 v62.1,32 59.8,29.7 v59.8,28.1
  Bottom 0.254: v35.3,30.9 36.5,29.7 64.12,29.7 J2.3 62.68,32.58 v62.1,32 | v62.1,52 62.1,47.1 v62,47 | J3.3 59.8,21.28 v59.8,28.1
TX
  Bottom 0.254: U$1.1 31.3,15.04 31.3,22.9 34.2,25.8 35,25.8 35.9,24.9 35.9,21.89 XB1.3
TX_STATUS  (via drill 0.35)
  Top 0.254: v31.1,61.8 32.05,62.75 R23.2
  Bottom 0.254: U$1.7 28.06,27.04 28.2,27.18 31.1,30.08 v31.1,61.8
XBEE_STATUS  (via drill 0.35)
  Top 0.254: v29.4,61.7 26.25,64.85 R25.2
  Bottom 0.254: v29.4,61.7 29.4,30.92 U$1.8

### Text on the board
tPlace: Stepper Controller Board | V1.0 2021 | /Users/kailab/Google Drive/Kai Lab/04 - ENGINEERING/07 - ELECTRONICS DESIGN/03 - EAGLE BMP/logo_&_type.bmp